# EAGLE design semtech-dev-board (EAGLE 8.2.2)
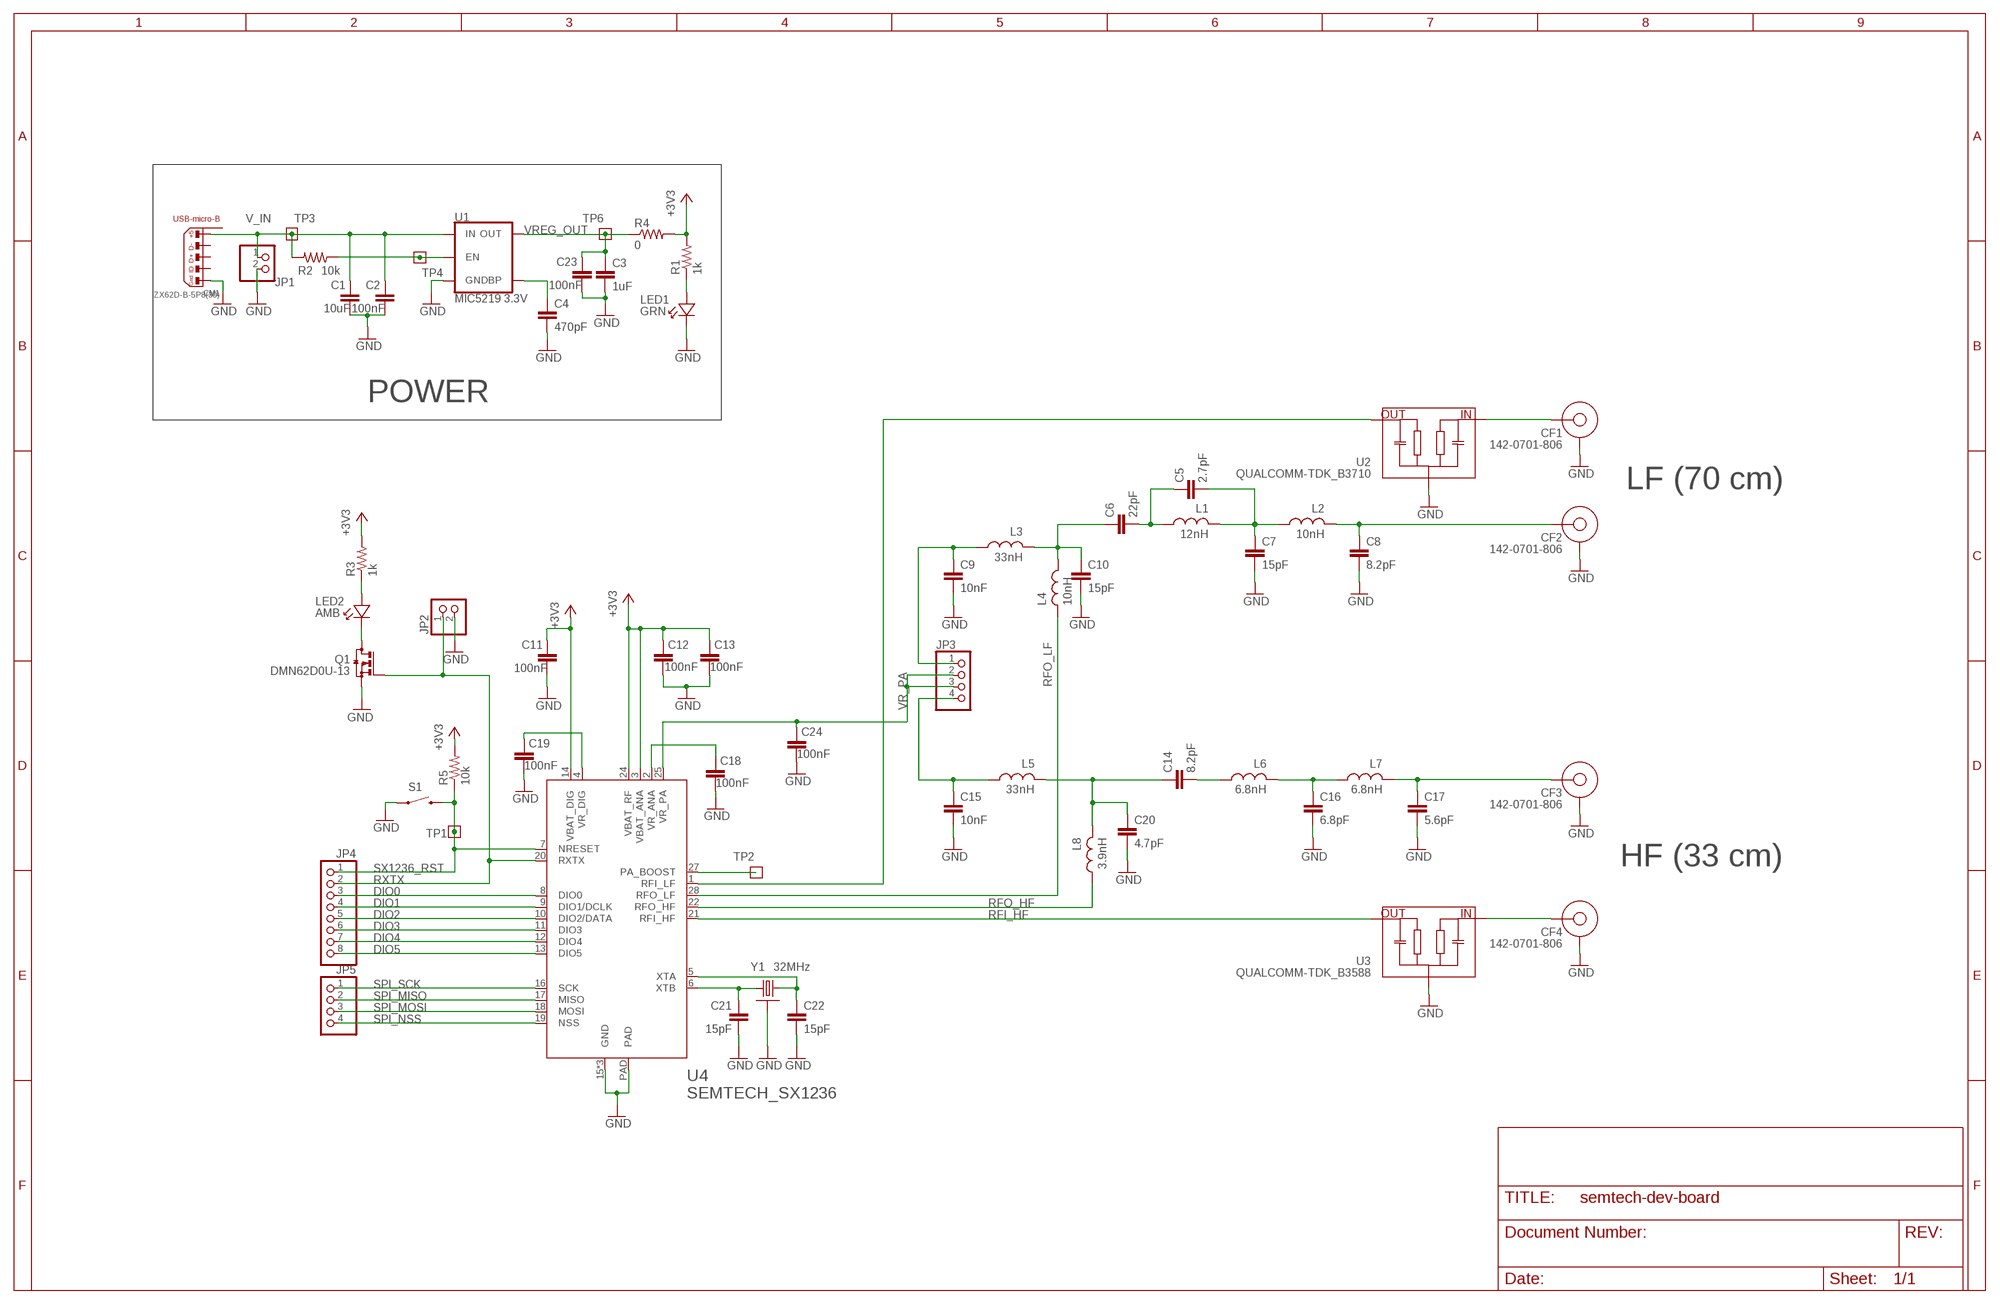
[diagram p0: schematic, sheet 1]

## Parts
C1  10uF  C-EU0805-B  [.0805-B]
C2  100nF  C-EU0603-B-NOSILK  [.0603-B-NOSILK]
C3  1uF  C-EU0603-B-NOSILK  [.0603-B-NOSILK]
C4  470pF  C-EU0603-B-NOSILK  [.0603-B-NOSILK]
C5  2.7pF  C-EU0603-B-NOSILK  [.0603-B-NOSILK]
C6  22pF  C-EU0603-B-NOSILK  [.0603-B-NOSILK]
C7  15pF  C-EU0603-B-NOSILK  [.0603-B-NOSILK]
C8  8.2pF  C-EU0603-B-NOSILK  [.0603-B-NOSILK]
C9  10nF  C-EU0603-B-NOSILK  [.0603-B-NOSILK]
C10  15pF  C-EU0603-B-NOSILK  [.0603-B-NOSILK]
C11  100nF  C-EU0603-B-NOSILK  [.0603-B-NOSILK]
C12  100nF  C-EU0603-B-NOSILK  [.0603-B-NOSILK]
C13  100nF  C-EU0603-B-NOSILK  [.0603-B-NOSILK]
C14  8.2pF  C-EU0603-B-NOSILK  [.0603-B-NOSILK]
C15  10nF  C-EU0603-B-NOSILK  [.0603-B-NOSILK]
C16  6.8pF  C-EU0603-B-NOSILK  [.0603-B-NOSILK]
C17  5.6pF  C-EU0603-B-NOSILK  [.0603-B-NOSILK]
C18  100nF  C-EU0603-B-NOSILK  [.0603-B-NOSILK]
C19  100nF  C-EU0603-B-NOSILK  [.0603-B-NOSILK]
C20  4.7pF  C-EU0603-B-NOSILK  [.0603-B-NOSILK]
C21  15pF  C-EU0603-B-NOSILK  [.0603-B-NOSILK]
C22  15pF  C-EU0603-B-NOSILK  [.0603-B-NOSILK]
C23  100nF  C-EU0603-B-NOSILK  [.0603-B-NOSILK]
C24  100nF  C-EU0603-B-NOSILK  [.0603-B-NOSILK]
CF1  142-0701-806  SMA-CINCH-END-FIRE  [SMAJ716-ND]
CF2  142-0701-806  SMA-CINCH-END-FIRE  [SMAJ716-ND]
CF3  142-0701-806  SMA-CINCH-END-FIRE  [SMAJ716-ND]
CF4  142-0701-806  SMA-CINCH-END-FIRE  [SMAJ716-ND]
CM1  ZX62D-B-5P8(30)  CON_USB-MICRO-B-RECEPTACLE-PTH-HIROSE-ZX62D-B-5P8  [USB-MICRO-B-PTH-HIROSE]
JP1  PINHD-1X2  [1X02]
JP2  PINHD-1X2  [1X02]
JP3  PINHD-1X4  [1X04]
JP4  PINHD-1X8  [1X08]
JP5  PINHD-1X4  [1X04]
L1  12nH  L-US0603-B-NOSILK  [.0603-B-NOSILK]
L2  10nH  L-US0603-B-NOSILK  [.0603-B-NOSILK]
L3  33nH  L-US0603-B-NOSILK  [.0603-B-NOSILK]
L4  10nH  L-US0603-B-NOSILK  [.0603-B-NOSILK]
L5  33nH  L-US0603-B-NOSILK  [.0603-B-NOSILK]
L6  6.8nH  L-US0603-B-NOSILK  [.0603-B-NOSILK]
L7  6.8nH  L-US0603-B-NOSILK  [.0603-B-NOSILK]
L8  3.9nH  L-US0603-B-NOSILK  [.0603-B-NOSILK]
LED1  GRN  LED-0603  [LED-0603]
LED2  AMB  LED-0603  [LED-0603]
Q1  DMN62D0U-13  BSS123  [SOT23]
R1  1k  R-US_0603-B-NOSILK  [.0603-B-NOSILK]
R2  10k  R-US_0603-B-NOSILK  [.0603-B-NOSILK]
R3  1k  R-US_0603-B-NOSILK  [.0603-B-NOSILK]
R4  0  R-US_0603-B-NOSILK  [.0603-B-NOSILK]
R5  10k  R-US_0603-B-NOSILK  [.0603-B-NOSILK]
S1  FSM4JSMATR  SWITCH-MOMENTARY-2SMD-2  [TACTILE_SWITCH_SMD-2]
TP1  TEST-POINT  [2MM-TEST-POINT]
TP2  TEST-POINT  [2MM-TEST-POINT]
TP3  TEST-POINT  [2MM-TEST-POINT]
TP4  TEST-POINT  [2MM-TEST-POINT]
TP6  TEST-POINT  [2MM-TEST-POINT]
U1  MIC5219 3.3V  V_REG_MIC52193.3V  [SOT23-5]
U2  QUALCOMM-TDK_B3710  [DCC6C-EPCOS]
U3  QUALCOMM-TDK_B3588  [DCC6C-EPCOS]
U4  SEMTECH_SX1236  [QFN28]
Y1  32MHz  CRYSTAL-WITH-GND  [CRYSTAL_2.5X2]

## Nets
+3V3: C11.1 C12.1 C13.1 R1.2 R3.2 R4.2 R5.2 U4.3(VBAT_ANA) U4.14(VBAT_DIG) U4.24(VBAT_RF)
BP: C4.1 U1.4(BP)
DIO0: JP4.3 U4.8(DIO0)
DIO1: JP4.4 U4.9(DIO1/DCLK)
DIO2: JP4.5 U4.10(DIO2/DATA)
DIO3: JP4.6 U4.11(DIO3)
DIO4: JP4.7 U4.12(DIO4)
DIO5: JP4.8 U4.13(DIO5)
GND: C1.2 C2.2 C3.2 C4.2 C7.2 C8.2 C9.2 C10.2 C11.2 C12.2 C13.2 C15.2 C16.2 C17.2 C18.2 C19.2 C20.2 C21.2 C22.2 C23.2 C24.2 CF1.GND1(GND) CF1.GND2(GND) CF1.GND3(GND) CF1.GND4(GND) CF2.GND1(GND) CF2.GND2(GND) CF2.GND3(GND) CF2.GND4(GND) CF3.GND1(GND) CF3.GND2(GND) CF3.GND3(GND) CF3.GND4(GND) CF4.GND1(GND) CF4.GND2(GND) CF4.GND3(GND) CF4.GND4(GND) CM1.5 JP1.2 JP2.2 LED1.K Q1.2(S) S1.2 U1.2(GND) U2.1(GND) U2.3(GND) U2.4(GND) U2.6(GND) U3.1(GND) U3.3(GND) U3.4(GND) U3.6(GND) U4.15(GND) U4.23(GND) U4.26(GND) U4.PAD Y1.2(SHIELD) Y1.4(SHIELD)
HFO_PA_HEAD: C15.1 JP3.4 L5.2
LED+: LED2.A R3.1
LED-: LED2.K Q1.3(D)
LFO_PA_HEAD: C9.1 JP3.1 L3.2
N$1: R2.1 TP4.1 U1.3(EN)
N$2: CF4.P$3(CENTERCONDUCTOR) U3.2(IN)
N$4: CF1.P$3(CENTERCONDUCTOR) U2.2(IN)
N$5: LED1.A R1.1
PA_BOOST: TP2.1 U4.27(PA_BOOST)
RFI_HF: U3.5(OUT) U4.21(RFI_HF)
RFI_LF: U2.5(OUT) U4.1(RFI_LF)
RFO_HF: L8.2 U4.22(RFO_HF)
RFO_HF_1: C14.2 L6.2
RFO_HF_2: C16.1 L6.1 L7.2
RFO_HF_OUT: C17.1 CF3.P$3(CENTERCONDUCTOR) L7.1
RFO_HF_PA: C14.1 C20.1 L5.1 L8.1
RFO_LF: L4.1 U4.28(RFO_LF)
RFO_LF_1: C5.1 C6.2 L1.2
RFO_LF_2: C5.2 C7.1 L1.1 L2.2
RFO_LF_OUT: C8.1 CF2.P$3(CENTERCONDUCTOR) L2.1
RFO_LF_PA: C6.1 C10.1 L3.1 L4.2
RXTX: JP2.1 JP4.2 Q1.1(G) U4.20(RXTX)
SPI_MISO: JP5.2 U4.17(MISO)
SPI_MOSI: JP5.3 U4.18(MOSI)
SPI_NSS: JP5.4 U4.19(NSS)
SPI_SCK: JP5.1 U4.16(SCK)
SX1236_RST: JP4.1 R5.1 S1.1 TP1.1 U4.7(NRESET)
V_IN: C1.1 C2.1 CM1.1 JP1.1 R2.2 TP3.1 U1.1(IN)
VR_ANA: C18.1 U4.2(VR_ANA)
VR_DIG: C19.1 U4.4(VR_DIG)
VR_PA: C24.1 JP3.2 JP3.3 U4.25(VR_PA)
VREG_OUT: C3.1 C23.1 R4.1 TP6.1 U1.5(OUT)
XTALA: C22.1 U4.5(XTA) Y1.3
XTALB: C21.1 U4.6(XTB) Y1.1
Unconnected: CM1.2 CM1.3 CM1.4 CM1.S1(SHIELD) CM1.S2(SHIELD) CM1.S3(SHIELD) CM1.S4(SHIELD)

## Notes on the sheet
- POWER
- LF (70 cm)
- HF (33 cm)

## Library data of the parts
C1-C24 = rcl_custom:C-EU: CAPACITOR, European symbol
CF1-CF4 = psas_c3_team05:SMA-CINCH-END-FIRE
CM1 = psas_c3_team05:CON_USB-MICRO-B-RECEPTACLE-*: Standard USB Micro-B receptacle
JP1 JP2 = pinhead:PINHD-1X2: PIN HEADER
JP3 JP5 = pinhead:PINHD-1X4: PIN HEADER
JP4 = pinhead:PINHD-1X8: PIN HEADER
L1-L8 = rcl_custom:L-US: INDUCTOR, American symbol
LED1 LED2 = low-gain-radio:LED: Generic LED with Color designator as an attribute.
Q1 = transistor-small-signal:BSS123: N-CHANNEL MOS FET
R1-R5 = rcl_custom:R-US_: RESISTOR, American symbol
S1 = psas_c3_team05:SWITCH-MOMENTARY-2
TP1-TP4 TP6 = low-gain-radio:TEST-POINT
U1 = SparkFun-IC-Power:V_REG_MIC5219: V_REG MIC5219 Standard 3.3V and 5V 500mA LDO voltage regulator in SOT-23 layout. Micrel part MIC5219. BP (by-pass) pin is used to lower output noise with 470pF cap, may be left open.; PROD_ID: VREG-09872
U2 = low-gain-radio:QUALCOMM-TDK_B3710: Qualcomm/TDK SAW FIlter 433.0-433.71 MHz
U3 = low-gain-radio:QUALCOMM-TDK_B3588: Qualcomm/TDK SAW Filter 902-928 MHz
U4 = low-gain-radio:SEMTECH_SX1236
Y1 = low-gain-radio:CRYSTAL-WITH-GND

## Board
Development board/ref design for Semtech SX1236
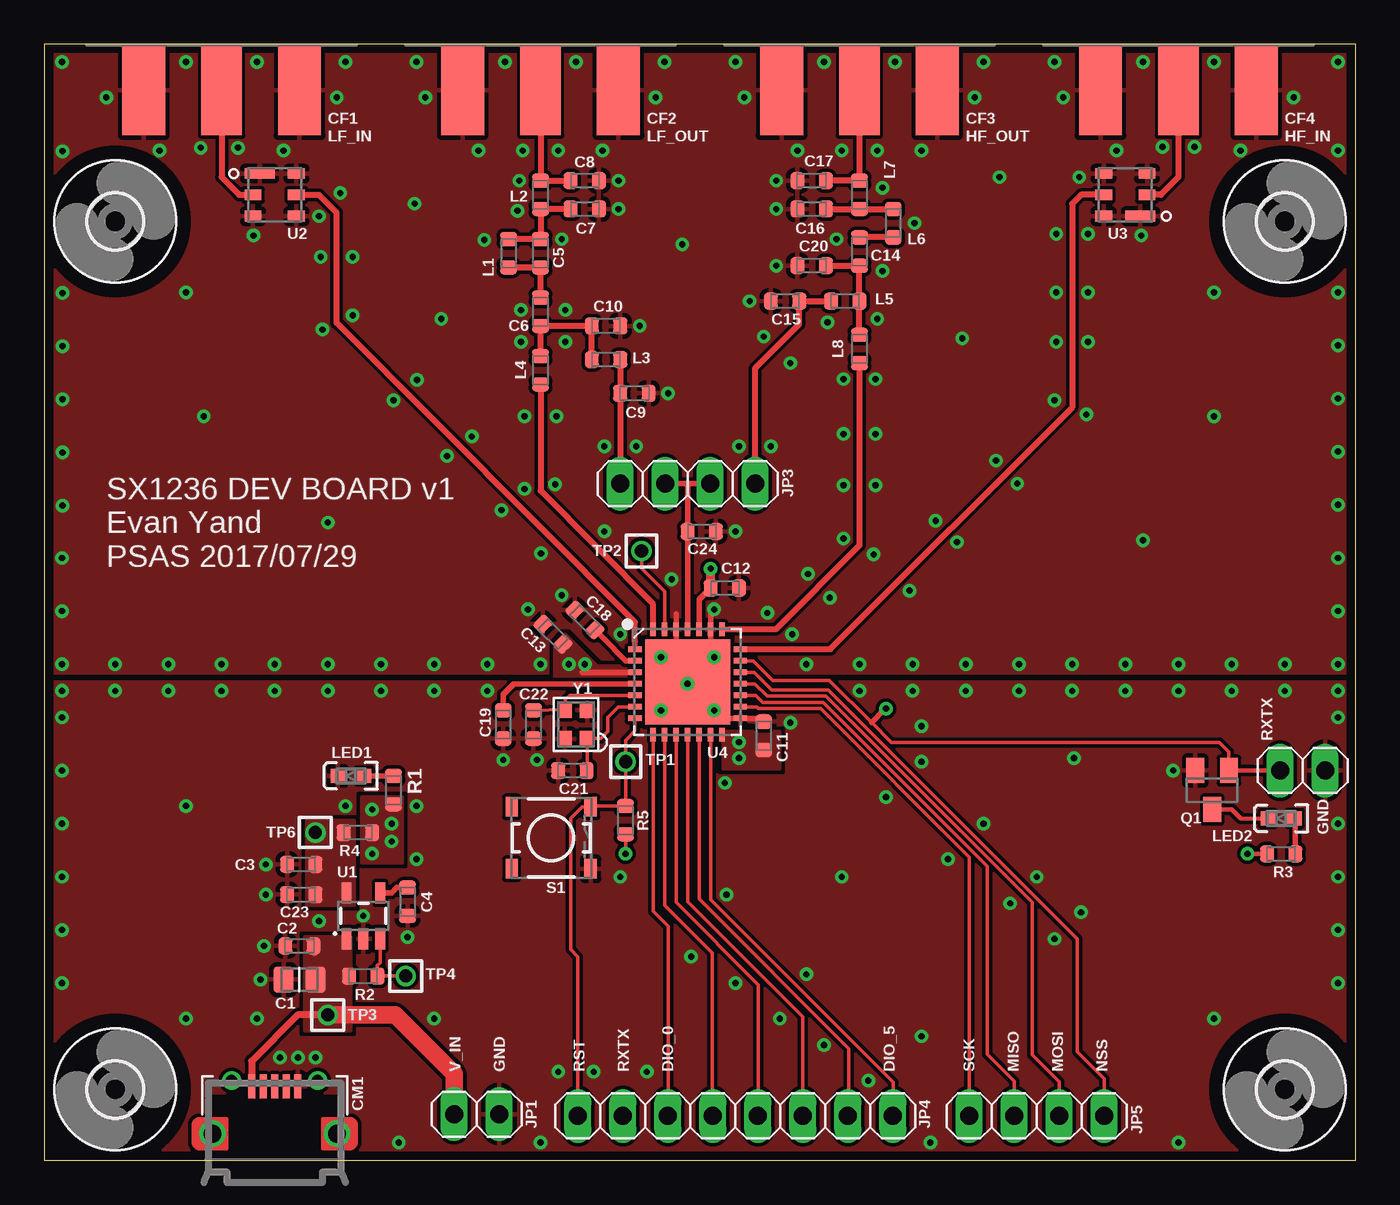
[diagram p1: board, top side]
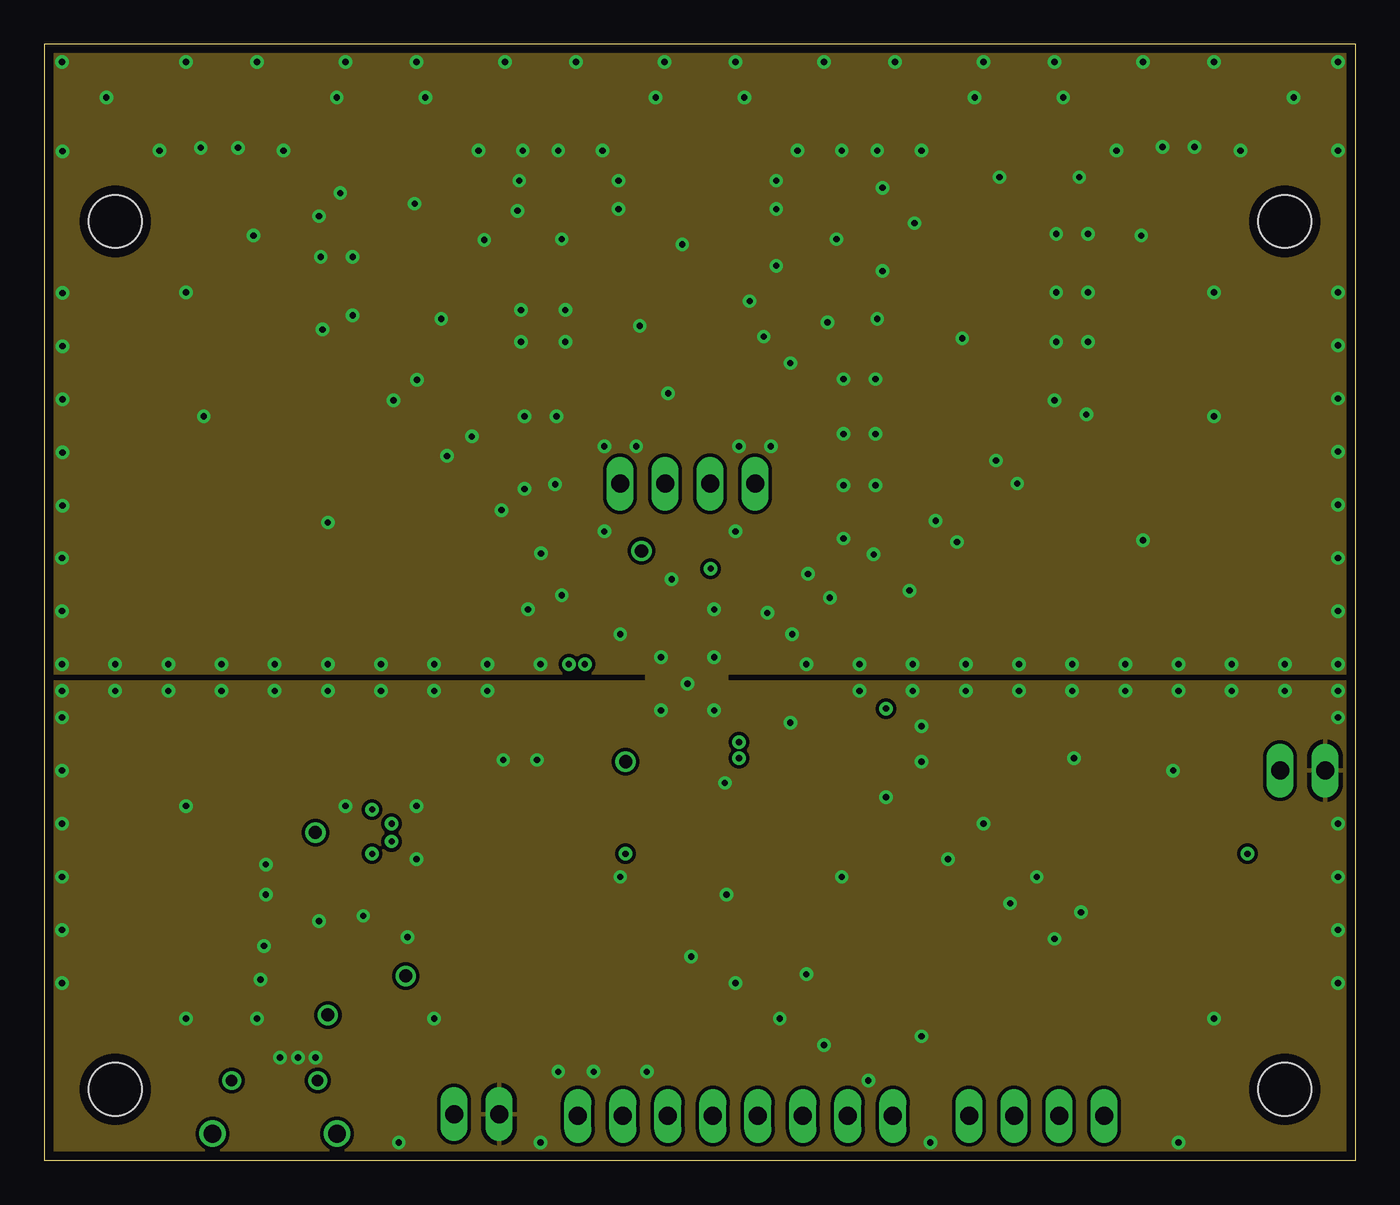
[diagram p2: board, inner layer Route2]
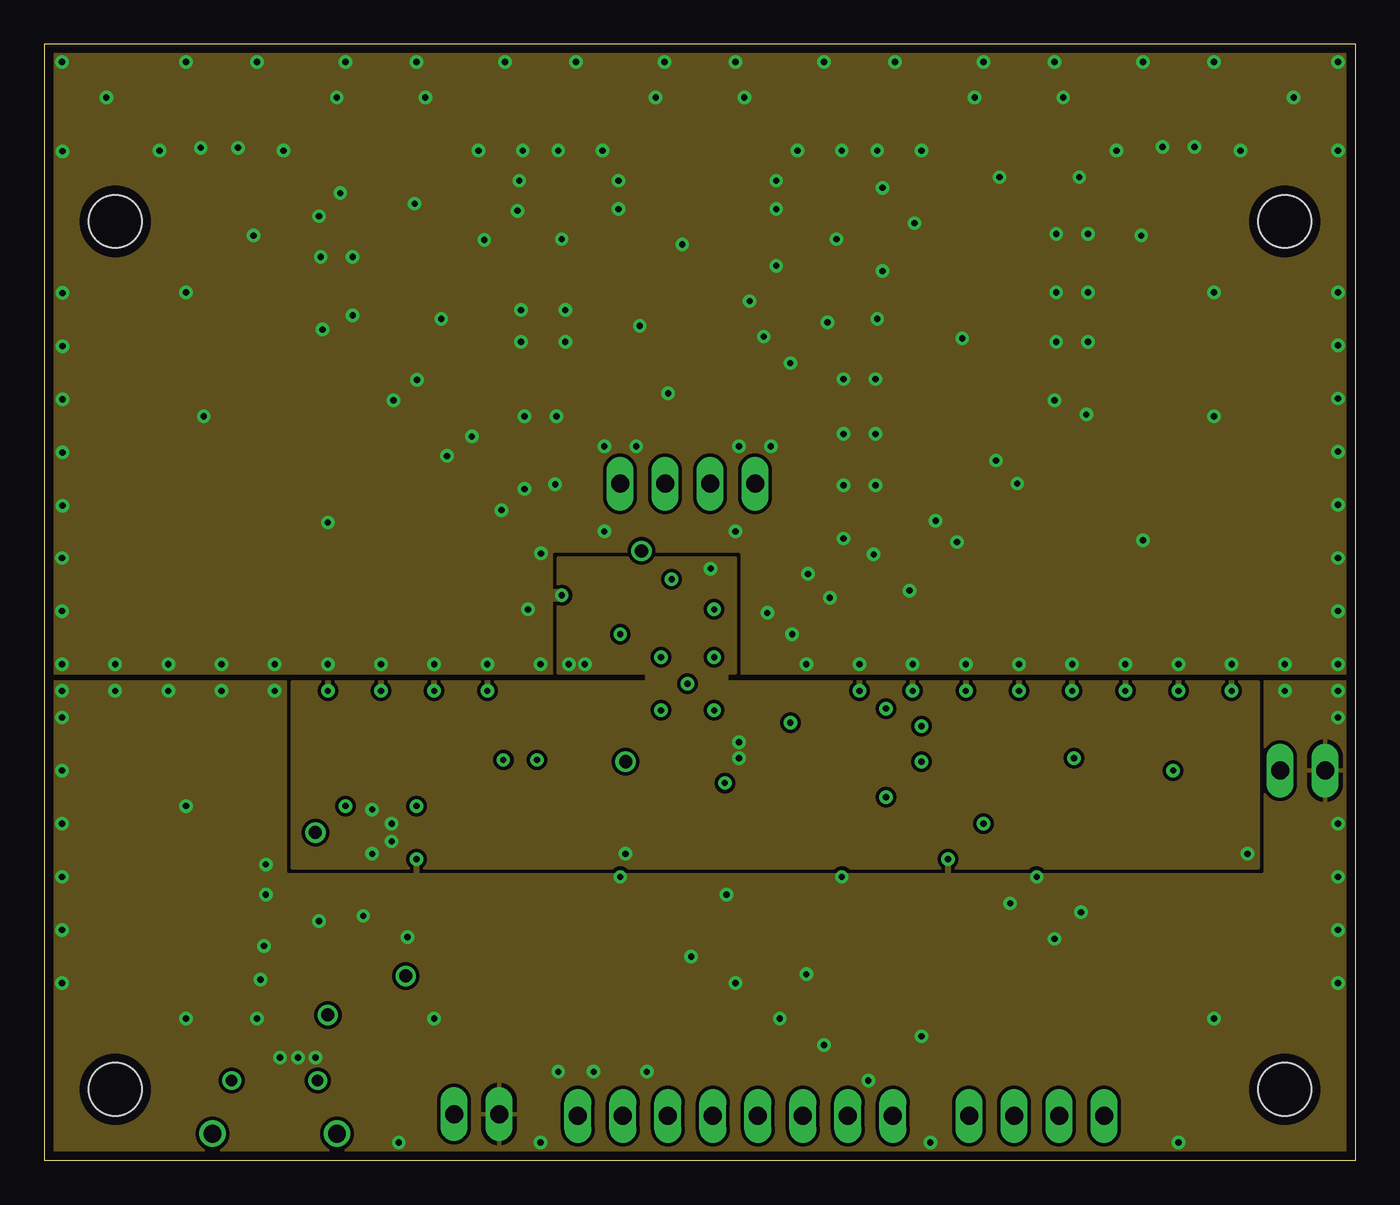
[diagram p3: board, inner layer Route15]
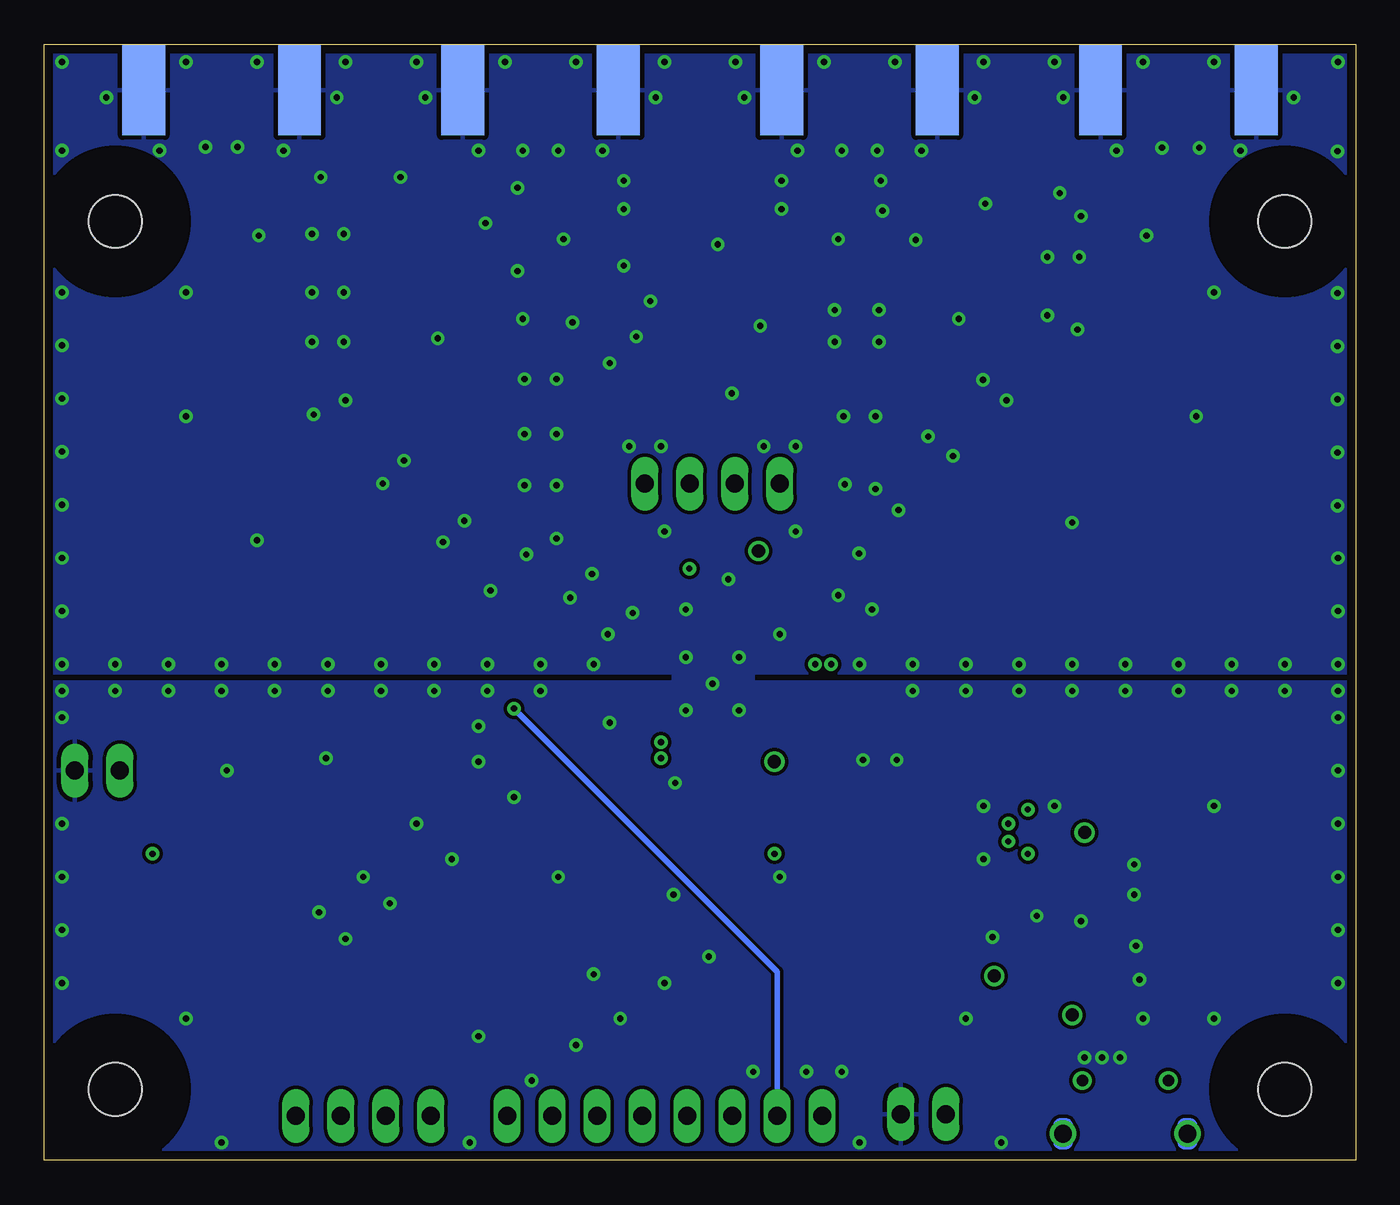
[diagram p4: board, bottom side, seen from below]

Size 74 x 63 mm. Coordinates in mm from the lower left corner, seen from the top.
Outline: 0,0 74,0 74,63 0,63 0,0
Copper layers (1+2*15+16): Top 0.0178mm / dielectric 12mil / Route2 0.0356mm / dielectric 28mil / Route15 0.0356mm / dielectric 12mil / Bottom 0.0178mm
Design rules "psas-4Lyr_v1.0.0.3 *": minimum track width 6mil, minimum drill 10mil, track to track 6mil, track to pad 6mil, pad to pad 6mil, via to via 6mil, smd to smd 6mil, copper to edge 20mil, drill to drill 16mil, minimum pad ring 8mil, minimum via ring 8mil, stop-mask expansion 3mil, vias tented up to drill 0.4mm, thermal gap 10mil

### Footprints (pad centres in the part's own frame; a part is rotated, then mirrored left to right if it is on the bottom)
.0805-B = smd 1.15 x 1.45: 1 -0.9,0; 2 0.9,0
.0603-B-NOSILK = smd 0.8 x 0.95: 1 -0.8,0; 2 0.8,0
SMAJ716-ND = smd 2.413 x 5.08 bottom: GND1 4.394,0; GND3 -4.394,0 | smd 2.413 x 5.08: GND2 -4.394,0; GND4 4.394,0 | smd 2.286 x 5.08: P$3 0,0
USB-MICRO-B-PTH-HIROSE = smd 0.4 x 1.35: 1 -1.3,2.675; 2 -0.65,2.675; 3 0,2.675; 4 0.65,2.675; 5 1.3,2.675 | drill 1: S1 -3.513,0; S2 3.513,0 | drill 0.65 pad 0.94: S3 2.425,3; S4 -2.425,3
1X02 = drill 1.016 long: 1 -1.27,0; 2 1.27,0
1X04 = drill 1.016 long: 1 -3.81,0; 2 -1.27,0; 3 1.27,0; 4 3.81,0
1X08 = drill 1.016 long: 1 -8.89,0; 2 -6.35,0; 3 -3.81,0; 4 -1.27,0; 5 1.27,0; 6 3.81,0; 7 6.35,0; 8 8.89,0
LED-0603 = smd 0.8 x 0.8: A 0.75,0; K -0.75,0
SOT23 = smd 1 x 1.4: 1 -0.95,-1.1; 2 0.95,-1.1; 3 0,1.1
TACTILE_SWITCH_SMD-2 = smd 0.7 x 1.1: 1 2.225,1.75; 2 2.225,-1.75; 3 -2.225,-1.75; 4 -2.225,1.75
2MM-TEST-POINT = drill 0.737: 1 0,0
SOT23-5 = smd 0.55 x 1.2: 1 -0.95,-1.3; 2 0,-1.3; 3 0.95,-1.3; 4 0.95,1.3; 5 -0.95,1.3
DCC6C-EPCOS = smd 0.6 x 1.7: 1 -1.2,-0.85 | smd 0.6 x 0.95: 2 0,-1.225; 3 1.2,-1.225; 4 1.2,1.225; 5 0,1.225; 6 -1.2,1.225
QFN28 = smd 0.75 x 0.3: 1 -2.975,1.95; 2 -2.975,1.3; 3 -2.975,0.65; 4 -2.975,0; 5 -2.975,-0.65; 6 -2.975,-1.3; 7 -2.975,-1.95; 15 2.975,-1.95; 16 2.975,-1.3; 17 2.975,-0.65; 18 2.975,0; 19 2.975,0.65; 20 2.975,1.3; 21 2.975,1.95 | smd 0.3 x 0.75: 8 -1.95,-2.875; 9 -1.3,-2.875; 10 -0.65,-2.875; 11 0,-2.875; 12 0.65,-2.875; 13 1.3,-2.875; 14 1.95,-2.875; 22 1.95,3.075; 23 1.3,3.075; 24 0.65,3.075; 25 0,3.075; 26 -0.65,3.075; 27 -1.3,3.075; 28 -1.95,3.075 | smd 4.8 x 4.8: PAD 0,0.1
3,0 = hole 3: 0,0
CRYSTAL_2.5X2 = smd 0.9 x 0.8: 1 -0.825,-0.625; 2 0.825,-0.625; 3 0.825,0.625; 4 -0.825,0.625

### Placement (x,y rotation side)
C1  14.4,10.2 180 top
C2  14.4,12.1 180 top
C3  14.5,16.7 180 top
C4  20.5,14.6 270 top
C5  28,51.2 90 top
C6  28,47.9 90 top
C7  30.5,53.7 0 top
C8  30.5,55.3 0 top
C9  33.3,43.3 0 top
C10  31.7,47.1 0 top
C11  40.6,23.96 90 top
C12  38.4,32.3 0 top
C13  28.7,29.7 135 top
C14  46,51.3 90 top
C15  41.8,48.5 180 top
C16  43.3,53.7 180 top
C17  43.3,55.3 180 top
C18  30.5,30.5 135 top
C19  25.9,24.6 270 top
C20  43.3,50.5 180 top
C21  29.8,22 180 top
C22  27.6,24.6 270 top
C23  14.5,15 180 top
C24  37.1,35.5 0 top
CF1  10,60.4 0 top
CF2  28,60.4 0 top
CF3  46,60.4 0 top
CF4  64,60.4 0 top
CM1  13,1.5 0 top
JP1  24.4,2.6 0 top
JP2  71,22 0 top
JP3  36.3,38.2 0 top
JP4  39,2.5 0 top
JP5  56,2.5 0 top
L1  26.2,51.2 270 top
L2  28,54.5 270 top
L3  31.7,45.2 0 top
L4  28,44.6 90 top
L5  45.2,48.5 180 top
L6  47.9,52.9 270 top
L7  46,54.5 270 top
L8  46,45.8 270 top
LED1  17.3,21.7 0 top
LED2  69.8,19.3 0 top
Q1  65.9,20.9 180 top
R1  19.7,20.9 270 top
R2  18,10.4 180 top
R3  69.8,17.3 180 top
R4  17.7,18.5 0 top
R5  32.8,19.2 270 top
S1  28.6,18.2 0 top
TP1  32.8,22.5 0 top
TP2  33.7,34.4 0 top
TP3  16,8.2 270 top
TP4  20.4,10.4 270 top
TP6  15.3,18.5 90 top
U1  18,13.8 0 top
U2  13,54.5 270 top
U3  61,54.5 90 top
U4  36.3,26.9 0 top
U$1  [SCOPE_CLIP]  2,31 0 top
U$2  [SCOPE_CLIP]  72,31 0 top
U$3  [SCOPE_CLIP]  2,46 0 top
U$5  [SCOPE_CLIP]  2,25 0 top
U$6  [SCOPE_CLIP]  2,10 0 top
U$7  [SCOPE_CLIP]  72,25 0 top
U$8  [3,0]  4,53 0 top
U$9  [3,0]  70,53 0 top
U$10  [3,0]  4,4 0 top
U$11  [3,0]  70,4 0 top
U$12  [SCOPE_CLIP]  72,46 0 top
U$13  [SCOPE_CLIP]  72,10 0 top
U$14  [SCOPE_CLIP]  64,2 90 top
U$15  [SCOPE_CLIP]  20,2 90 top
Y1  30,24.6 90 top

### Tracks (layer width: path | path; a pad name or v marks a point on that pad's centre or on a via)
+3V3  (via drill 0.35)
  Top 0.2: R5.2 v32.8,17.3
  Top 0.25: R3.2 v67.9,17.3
  Top 0.3: U4.24 36.95,31.65 C12.1 | U4.3 30.35,27.55
  Top 0.5: C12.1 v37.6,33.4
  other vias: 18.5,19.8 19.6,18 19.6,19 18.5,17.3 29.6,28 30.5,28 39.2,22.7 39.2,23.6
  pour Route15 (isolate 0.2): 29,34 29,27.5 34,27.5 34,27 14,27 14,16.5 68.5,16.5 68.5,27 38.5,27 38.5,27.5 39,27.5 39,34
  pour Top (isolate 0.2, no thermals): 28.8,29.1 29.4,29.7 31.2,27.9 32.8,27.9 32.8,27.2 28.8,27.2
  pour Top (no thermals): 17.9,20.5 17.9,16.8 20.2,16.8 20.2,20.5
  pour Top (isolate 0.2, no thermals): 38.3,24.2 38.3,22.1 41.5,22.1 41.5,24.2
BP
  Top 0.3: U1.4 19.6,15.1 19.9,15.4 C4.1
DIO0
  Top 0.2: U4.8 34.35,17.8 34.35,14.05 35.2,13.2 JP4.3
DIO1
  Top 0.2: U4.9 35,17.75 35,14.4 37.7,11.7 37.7,2.53 JP4.4
DIO2
  Top 0.2: U4.10 35.65,18.4 35.65,14.55 40.3,9.9 40.3,2.53 JP4.5
DIO3
  Top 0.2: U4.11 36.3,19.25 36.3,14.6 42.8,8.1 JP4.6
DIO4
  Top 0.2: U4.12 36.95,20 36.95,14.75 45.4,6.3 45.4,2.55 JP4.7
DIO5
  Top 0.2: U4.13 37.6,20.55 37.6,14.7 47.9,4.4 JP4.8
GND  (via drill 0.35)
  Top 0.2: 35.65,30.85 35.7,30.9
  Top 0.3: v37.8,25.4 38.25,24.95 U4.15 40.41,24.95 C11.2 | 35.6,29 35.65,29.05 U4.26 35.65,30.85 | 37.6,29.1 U4.23 37.6,30.9
  other vias: 38.4,21.3 42.1,24.7 15.3,5.8 13.3,5.8 14.32,5.8 1,25 12.5,16.7 49.5,22.5 63.7,22 28.03,34.26 20,1 25.9,22.6 1,10 25.8,36.7 22.73,39.76 19.7,42.9 15.7,46.9 17.4,51 16.7,54.6 8.83,57.16 10.93,57.16 17,62 16.5,60 13.5,57 1.03,56.96 1,62 24.5,57 21.5,60 21,62 36,51.7 27,57 26.8,55.3 24.83,51.96 11.8,52.2 15.6,51 17.4,47.7 26.9,48 21.03,44.06 24.13,40.86 32.4,53.7 32.4,55.3 31.5,57 29,57 34.5,60 35,62 30,62 39,62 39.5,60 42.5,57 49.5,57 41.3,55.3 41.3,53.7 41.3,50.5 39.8,48.5 33.6,47.1 35.2,43.3 44,62 60.5,57 52.5,60 53,62 48,62 49.1,52.9 47.3,50.2 46.9,41 46.9,38.1 46.8,34.2 44.33,31.76 43.1,33.1 45.1,35.1 45.1,38.1 45.1,41 35.4,32.8 31.6,35.5 28.83,38.16 48.83,32.16 50.3,36.1 53.7,39.5 57,42.9 57.1,46.2 57.1,49 58.9,52.3 61.9,52.2 67.5,57 62,62 58.4,55.5 57.1,52.3 58.9,49 58.9,46.2 58.8,42.1 54.9,38.2 51.5,34.9 57,62 57.5,60 70.5,60 73,62 6.5,57 8,62 12,62 26,62 66,62 1.03,48.96 1.03,45.96 73,57 73,49 73,46 73,43 73,40 73,37 73,34 73,31 1.03,42.96 1.03,39.96 1.03,36.96 1,34 1,31 43,28 46,28 49,28 52,28 55,28 58,28 61,28 64,28 67,28 70,28 1,28 73,28 4,28 7,28 10,28 13,28 16,28 19,28 22,28 29.2,31.9 27.3,31.1 32.5,29.7 73,25 73,10 73,13 73,16 73,19 1,22 1,19 1,16 1,13 64,1 27.8,22.6 47,47.5 45,57 47,57 3.5,60 15.5,53.3 42.2,29.7 40.8,30.9 27.1,37.9 63.1,57.2 64.9,57.2 18,13.8 25,28 37.8,31.1 37.8,28.4 34.8,28.4 34.8,25.4 36.3,26.9 4,26.5 7,26.5 10,26.5 13,26.5 16,26.5 19,26.5 22,26.5 25,26.5 46,26.5 49,26.5 52,26.5 55,26.5 58,26.5 61,26.5 64,26.5 67,26.5 70,26.5 73,26.5 1,26.5 49.5,24.5 47.5,20.5 51,17 53,19 54.5,14.5 56,16 57,12.5 58.5,14 50,1 28,1 22,8 20.5,12.6 21,20 12,8 12.5,15 12.4,12.1 12.2,10.2 21,17 58.1,22.7 66,8 8,8 8,49 66,49 66,42 62,35 9,42 16,36 8,20 17,20 15.5,13.5 43,10.5 36.5,11.5 34,5 31,5 29,5 32.5,16 39,10 41.5,8 44,6.5 46.5,4.5 38.5,15 45,16 49.5,7 28,28 39,35.5 42.1,45 44.7,52 40.6,46.5 29.2,52 26.7,53.6 29.4,46.2 29.4,48 28.9,42 27.1,42 26.9,46.2 47.3,54.9 45.1,44.1 46.9,44.1 44.2,47.3 41,40.3 39.2,40.3 33.4,40.3 31.6,40.3 51.8,46.4 53.9,55.5 20.9,54 22.4,47.5
  pour Top (isolate 0.2, rank 6): 74,27.5 0,27.5 0,63 74,63
  pour Top (isolate 0.2, rank 6): 0,27 74,27 74,0 0,0
  pour Route2 (isolate 0.2): 0,27.5 34,27.5 34,27 38.5,27 38.5,27.5 74,27.5 74,63 0,63
  pour Bottom (isolate 0.2, rank 6): 32,27 74,27 74,0 0,0 0,27
  pour Bottom (isolate 0.2, rank 6): 0,27.5 0,63 74,63 74,27.5 38.5,27.5 38.5,27 34,27 34,27.5
  pour Route15 (isolate 0.2, rank 6): 0,27.5 74,27.5 74,63 0,63
  pour Route2 (isolate 0.2): 0,0 74,0 74,27 0,27
  pour Route15 (isolate 0.2, rank 6): 0,0 74,0 74,27 0,27
HFO_PA_HEAD
  Top 0.343: L5.2 C15.1 42.6,47.2 40.11,44.71 JP3.4
LED+
  Top 0.152: 70.6,19.25 LED2.A
  Top 0.3: R3.1 70.6,19.25
LED-
  Top 0.23: 67.5,19.3 LED2.K
  Top 0.25: Q1.3 67,19.8 67.5,19.3
LFO_PA_HEAD
  Top 0.343: L3.2 C9.1 JP3.1
N$1
  Top 0.2: U1.3 18.95,11.15 18.8,11 R2.1 TP4.1
N$2
  Top 0.343: CF4.P$3 64,55.5 63,54.5 U3.2
N$4
  Top 0.343: CF1.P$3 10,55.5 11,54.5 U2.2
N$5
  Top 0.3: R1.1 LED1.A
PA_BOOST
  Top 0.2: U4.27 35,32.1 33.7,33.4 TP2.1
RFI_HF
  Top 0.343: U4.21 44.35,28.85 58,42.5 58,54 58.5,54.5 U3.5
RFI_LF
  Top 0.3: U4.1 33.33,29.3
  Top 0.343: 16.5,47.29 16.5,53.5 15.5,54.5 U2.5 | 16.5,47.29 16.62,47.17 | 33.33,29.3 33.33,30.39 16.5,47.29
RFO_HF
  Top 0.3: 38.62,29.98 U4.22
  Top 0.343: L8.2 46,34.71 41.27,29.98 38.62,29.98
RFO_HF_1
  Top 0.343: L6.2 C14.2
RFO_HF_2
  Top 0.343: C16.1 L7.2 L6.1
RFO_HF_OUT
  Top 0.343: C17.1 L7.1 CF3.P$3
RFO_HF_PA
  Top 0.343: C20.1 C14.1 L5.1 L8.1
RFO_LF
  Top 0.3: U4.28 34.35,30.5
  Top 0.343: 34.35,30.5 34.35,31.4 28,37.8 L4.1
RFO_LF_1
  Top 0.343: L1.2 C5.1 C6.2
RFO_LF_2
  Top 0.343: C7.1 L2.2 C5.2 26.6,52 26.4,51.8 L1.1
RFO_LF_OUT
  Top 0.343: C8.1 L2.1 CF2.P$3
RFO_LF_PA
  Top 0.343: L4.2 C6.1 C10.1 L3.1
RXTX  (via drill 0.35)
  Top 0.2: U4.20 40,28.2 41.1,27.1 44.3,27.1 46.68,24.72 47.8,23.6 66.3,23.6 66.85,23.05 Q1.1
  Top 0.25: JP2.1 Q1.1
  Top 0.3: v47.5,25.5 47.47,25.5 46.68,24.72
  Bottom 0.3: JP4.2 32.65,10.65 v47.5,25.5
SPI_MISO
  Top 0.2: U4.17 40.15,26.25 40.55,25.85 43.95,25.85 53.2,16.59 53.2,6 54.73,4.47 JP5.2
SPI_MOSI
  Top 0.2: U4.18 40.1,26.9 40.8,26.2 44.09,26.2 55.74,14.55 55.74,5.96 57.27,4.43 JP5.3
SPI_NSS
  Top 0.2: U4.19 40.05,27.55 41.04,26.56 44.24,26.56 58.28,12.51 58.28,6.12 59.81,4.59 JP5.4
SPI_SCK
  Top 0.2: U4.16 40.2,25.6 40.3,25.5 43.8,25.5 52.19,17.11 JP5.1
SX1236_RST
  Top 0.2: U4.7 33.33,24.23 32.8,23.7 TP1.1 R5.1 30.88,20 S1.1 30.35,19.95 29.7,19.3 29.7,11.9 30.11,11.49 JP4.1
V_IN
  Top 0.2: 15.2,11.75 15.24,11.71
  Top 0.4: TP3.1 14.3,8.2 11.7,5.6 CM1.1
  Top 0.406: 15.24,11.71 C2.1
  Top 1: JP1.1 23.13,4.87 19.8,8.2 TP3.1
  pour Top (no thermals): 14.7,7.3 14.7,12.6 17.3,12.6 17.3,7.3
VR_ANA
  Top 0.3: U4.2 32.8,28.2 31.5,29.5 | 31.5,29.5 | 31.5,29.5 C18.1
VR_DIG
  Top 0.3: C19.1 25.9,26.3 26.5,26.9 U4.4
VR_PA
  Top 0.3: JP3.3 36.3,38.2 | JP3.2 36.3,38.2 | U4.25 C24.1 36.3,38.2
VREG_OUT
  pour Top (no thermals): 14.8,14.4 14.8,19.2 17.5,19.2 17.5,14.4
XTALA
  Top 0.2: C22.1 29.35,25.45 Y1.3 29.4,25.45 29.4,26 29.65,26.25 U4.5
XTALB
  Top 0.2: C21.1 30.62,22.02 Y1.1 30.65,23.8 31.4,23.8 31.8,24.2 31.8,25 32.4,25.6 U4.6

### Text on the board
tPlace: SX1236 DEV BOARD v1 / Evan Yand / PSAS 2017/07/29
tNames: LF_IN | LF_OUT | HF_OUT | HF_IN | RXTX | GND | V_IN | GND | RST | RXTX | DIO_0 | DIO_5 | SCK | MISO | MOSI | NSS
tSilk: Board #